# Altium schematic sheet __Semikron_SKS_170F_B6Ci_141_V12.SchDoc
size A; SheetNumber: 1; SheetTotal: 2
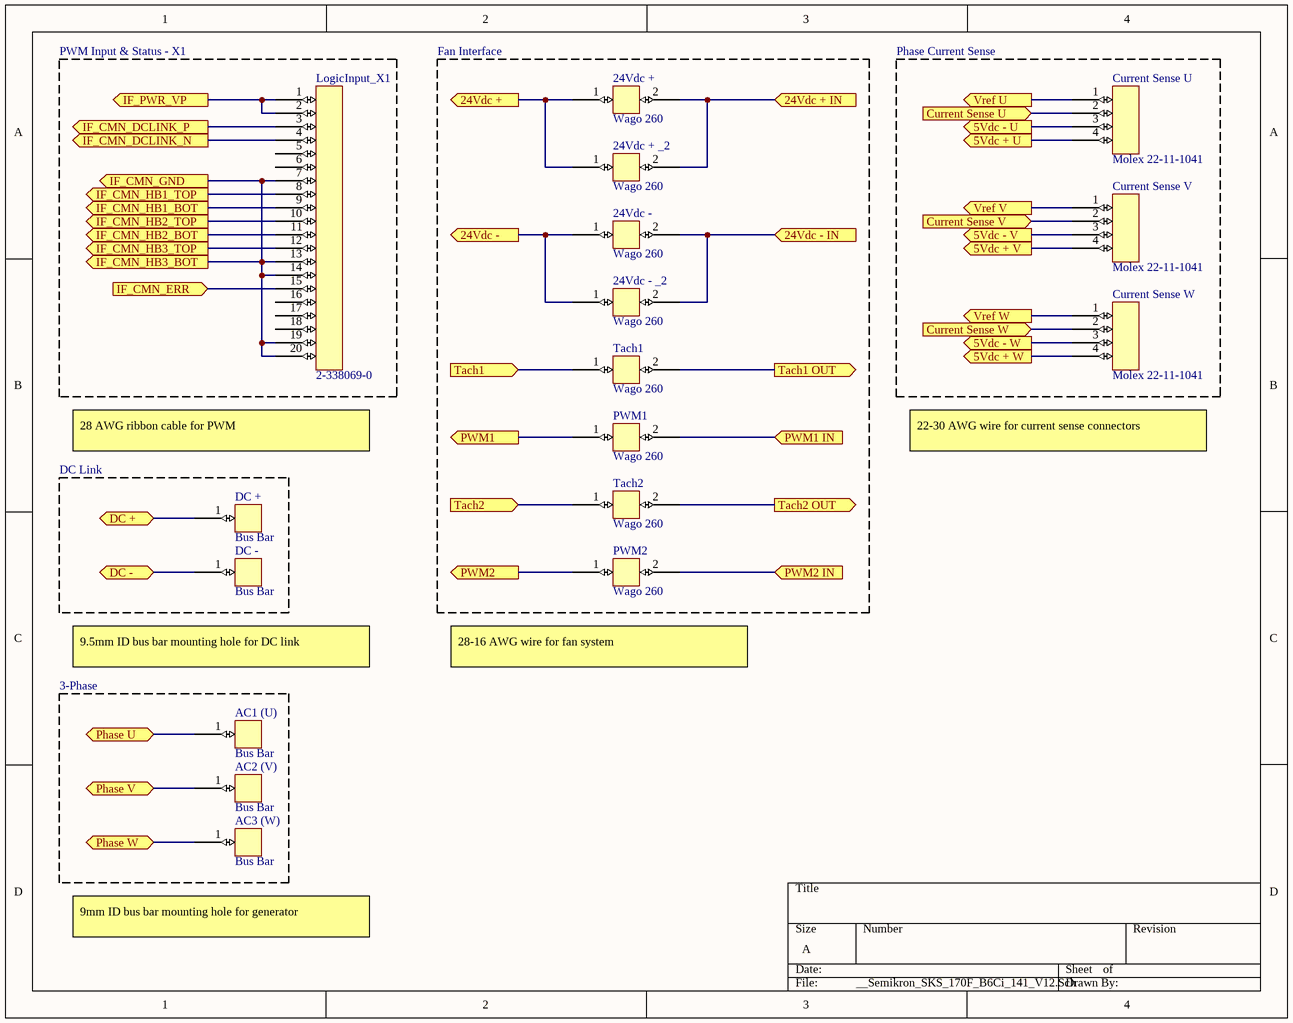
[diagram p0: __Semikron_SKS_170F_B6Ci_141_V12.SchDoc]

## Parts
24Vdc_+  Wago 260
24Vdc_+__2  Wago 260
24Vdc_-  Wago 260
24Vdc_-__2  Wago 260
AC1_(U)  Bus Bar
AC2_(V)  Bus Bar
AC3_(W)  Bus Bar
Current_Sense_U  Molex 22-11-1041
Current_Sense_V  Molex 22-11-1041
Current_Sense_W  Molex 22-11-1041
DC_+  Bus Bar
DC_-  Bus Bar
LogicInput_X1  2-338069-0
PWM1  Wago 260
PWM2  Wago 260
Tach1  Wago 260
Tach2  Wago 260

## Blocks framed on the sheet
PWM Input & Status - X1: LogicInput_X1
Fan Interface: 24Vdc_+ 24Vdc_+__2 24Vdc_- 24Vdc_-__2 PWM1 PWM2 Tach1 Tach2
Phase Current Sense: Current_Sense_U Current_Sense_V Current_Sense_W
DC Link: DC_+ DC_-
3-Phase: AC1_(U) AC2_(V) AC3_(W)

## Ports
5Vdc + U (out), 5Vdc + V (out), 5Vdc + W (out), 5Vdc - U (out), 5Vdc - V (out), 5Vdc - W (out), 24Vdc + (out), 24Vdc + IN (in), 24Vdc - (out), 24Vdc - IN (in), Current Sense U (in), Current Sense V (in), Current Sense W (in), DC + (bidir), DC - (bidir), IF_CMN_DCLINK_N (out), IF_CMN_DCLINK_P (out), IF_CMN_ERR (in), IF_CMN_GND (out), IF_CMN_HB1_BOT (out), IF_CMN_HB1_TOP (out), IF_CMN_HB2_BOT (out), IF_CMN_HB2_TOP (out), IF_CMN_HB3_BOT (out), IF_CMN_HB3_TOP (out), IF_PWR_VP (out), Phase U (bidir), Phase V (bidir), Phase W (bidir), PWM1 (out), PWM1 IN (in), PWM2 (out), PWM2 IN (in), Tach1 (in), Tach1 OUT (out), Tach2 (in), Tach2 OUT (out), Vref U (out), Vref V (out), Vref W (out)

## Nets
5Vdc + U: Current_Sense_U.4 ; port 5Vdc + U
5Vdc + V: Current_Sense_V.4 ; port 5Vdc + V
5Vdc + W: Current_Sense_W.4 ; port 5Vdc + W
5Vdc - U: Current_Sense_U.3 ; port 5Vdc - U
5Vdc - V: Current_Sense_V.3 ; port 5Vdc - V
5Vdc - W: Current_Sense_W.3 ; port 5Vdc - W
24Vdc +: 24Vdc_+.1 24Vdc_+__2.1 ; port 24Vdc +
24Vdc + IN: 24Vdc_+.2 24Vdc_+__2.2 ; port 24Vdc + IN
24Vdc -: 24Vdc_-.1 24Vdc_-__2.1 ; port 24Vdc -
24Vdc - IN: 24Vdc_-.2 24Vdc_-__2.2 ; port 24Vdc - IN
Current Sense U: Current_Sense_U.2 ; port Current Sense U
Current Sense V: Current_Sense_V.2 ; port Current Sense V
Current Sense W: Current_Sense_W.2 ; port Current Sense W
DC +: DC_+.1 ; port DC +
DC -: DC_-.1 ; port DC -
IF_CMN_DCLINK_N: LogicInput_X1.4 ; port IF_CMN_DCLINK_N
IF_CMN_DCLINK_P: LogicInput_X1.3 ; port IF_CMN_DCLINK_P
IF_CMN_ERR: LogicInput_X1.15 ; port IF_CMN_ERR
IF_CMN_GND: LogicInput_X1.7 LogicInput_X1.13 LogicInput_X1.14 LogicInput_X1.19 LogicInput_X1.20 ; port IF_CMN_GND, port IF_CMN_HB3_BOT
IF_CMN_HB1_BOT: LogicInput_X1.9 ; port IF_CMN_HB1_BOT
IF_CMN_HB1_TOP: LogicInput_X1.8 ; port IF_CMN_HB1_TOP
IF_CMN_HB2_BOT: LogicInput_X1.11 ; port IF_CMN_HB2_BOT
IF_CMN_HB2_TOP: LogicInput_X1.10 ; port IF_CMN_HB2_TOP
IF_CMN_HB3_TOP: LogicInput_X1.12 ; port IF_CMN_HB3_TOP
IF_PWR_VP: LogicInput_X1.1 LogicInput_X1.2 ; port IF_PWR_VP
Phase U: AC1_(U).1 ; port Phase U
Phase V: AC2_(V).1 ; port Phase V
Phase W: AC3_(W).1 ; port Phase W
PWM1: PWM1.1 ; port PWM1
PWM1 IN: PWM1.2 ; port PWM1 IN
PWM2: PWM2.1 ; port PWM2
PWM2 IN: PWM2.2 ; port PWM2 IN
Tach1: Tach1.1 ; port Tach1
Tach1 OUT: Tach1.2 ; port Tach1 OUT
Tach2: Tach2.1 ; port Tach2
Tach2 OUT: Tach2.2 ; port Tach2 OUT
Vref U: Current_Sense_U.1 ; port Vref U
Vref V: Current_Sense_V.1 ; port Vref V
Vref W: Current_Sense_W.1 ; port Vref W

Not connected (* = marked no-connect by the designer): LogicInput_X1 5 6 16 17 18

## Notes on the sheet
- 28 AWG ribbon cable for PWM
- 22-30 AWG wire for current sense connectors
- 9.5mm ID bus bar mounting hole for DC link
- 28-16 AWG wire for fan system
- 9mm ID bus bar mounting hole for generator

## Library data of the parts
24Vdc_+ 24Vdc_+__2 24Vdc_- 24Vdc_-__2 PWM1 PWM2 Tach1 Tach2 = CMP-002-00072-2: 28-16AWG Spring Clamp Terminal Block - DIN Mountable
AC1_(U) AC2_(V) AC3_(W) DC_+ DC_- = CMP-001-0000-1: Single Connection bus bar
Current_Sense_U Current_Sense_V Current_Sense_W = CMP-002-00073-1: Headers & Wire Housings 2.5MM VERT 4P HDR W/FRICTION RAMP AU
LogicInput_X1 = CMP-002-00071-1: Conn FFC Connector F 20 POS 2.54mm Solder ST SMD T/R